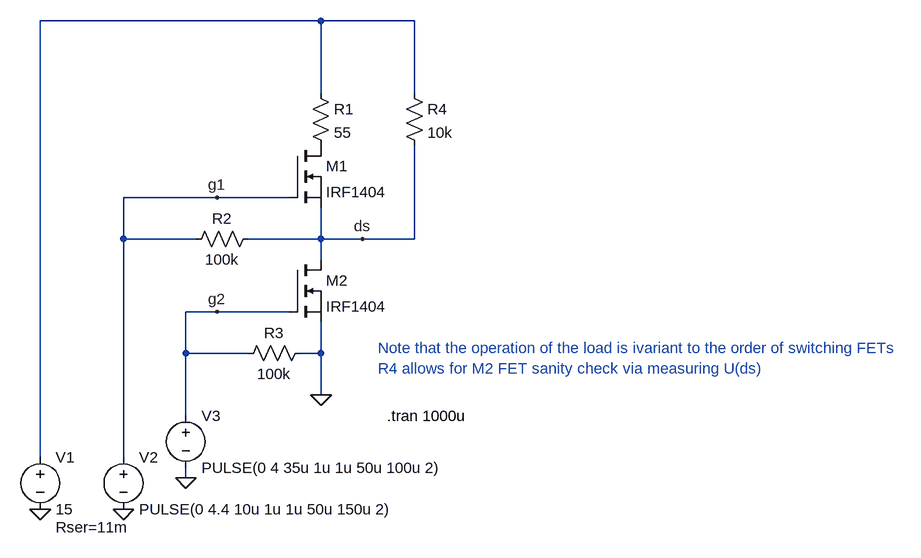
[diagram p0: schematic failsafe-switching.asc]
failsafe-switching.asc, the LTspice schematic file:
Version 4
SHEET 1 1148 700
WIRE 112 -96 -320 -96
WIRE 256 -96 112 -96
WIRE 112 16 112 -96
WIRE 256 16 256 -96
WIRE -48 176 -192 176
WIRE 64 176 -48 176
WIRE -192 240 -192 176
WIRE -80 240 -192 240
WIRE 112 240 112 192
WIRE 112 240 0 240
WIRE 176 240 112 240
WIRE 256 240 256 96
WIRE 256 240 176 240
WIRE 112 272 112 240
WIRE -48 352 -96 352
WIRE 64 352 -48 352
WIRE -96 416 -96 352
WIRE 0 416 -96 416
WIRE 112 416 112 368
WIRE 112 416 80 416
WIRE 112 480 112 416
WIRE -96 512 -96 416
WIRE -320 576 -320 -96
WIRE -192 576 -192 240
WIRE -96 608 -96 592
FLAG 112 480 0
FLAG -320 656 0
FLAG -192 656 0
FLAG -96 608 0
FLAG -48 176 g1
FLAG -48 352 g2
FLAG 176 240 ds
SYMBOL nmos 64 96 R0
SYMATTR InstName M1
SYMATTR Value IRF1404
SYMBOL nmos 64 272 R0
SYMATTR InstName M2
SYMATTR Value IRF1404
SYMBOL res 96 0 R0
SYMATTR InstName R1
SYMATTR Value 55
SYMBOL voltage -320 560 R0
WINDOW 123 0 0 Left 0
WINDOW 39 24 124 Left 2
SYMATTR InstName V1
SYMATTR Value 15
SYMATTR SpiceLine Rser=11m
SYMBOL voltage -192 560 R0
WINDOW 123 0 0 Left 0
WINDOW 39 0 0 Left 0
SYMATTR InstName V2
SYMATTR Value PULSE(0 4.4 10u 1u 1u 50u 150u 2)
SYMBOL voltage -96 496 R0
WINDOW 123 0 0 Left 0
WINDOW 39 0 0 Left 0
SYMATTR InstName V3
SYMATTR Value PULSE(0 4 35u 1u 1u 50u 100u 2)
SYMBOL res 16 224 R90
WINDOW 0 0 56 VBottom 2
WINDOW 3 32 56 VTop 2
SYMATTR InstName R2
SYMATTR Value 100k
SYMBOL res 96 400 R90
WINDOW 0 0 56 VBottom 2
WINDOW 3 32 56 VTop 2
SYMATTR InstName R3
SYMATTR Value 100k
SYMBOL res 240 0 R0
SYMATTR InstName R4
SYMATTR Value 10k
TEXT 214 512 Left 2 !.tran 1000u
TEXT 200 408 Left 2 ;Note that the operation of the load is ivariant to the order of switching FETs\nR4 allows for M2 FET sanity check via measuring U(ds)

The netlist it stands for:
* failsafe-switching.asc
M1 P001 g1 ds ds IRF1404
M2 ds g2 0 0 IRF1404
R1 N001 P001 55
V1 N001 0 15 Rser=11m
V2 g1 0 PULSE(0 4.4 10u 1u 1u 50u 150u 2)
V3 g2 0 PULSE(0 4 35u 1u 1u 50u 100u 2)
R2 ds g1 100k
R3 0 g2 100k
R4 N001 ds 10k
.model NMOS NMOS
.model PMOS PMOS
.lib standard.mos
.tran 1000u
* Note that the operation of the load is ivariant to the order of switching FETs
* R4 allows for M2 FET sanity check via measuring U(ds)
.backanno
.end